# Altium schematic sheet LED_V2.SchDoc
size A
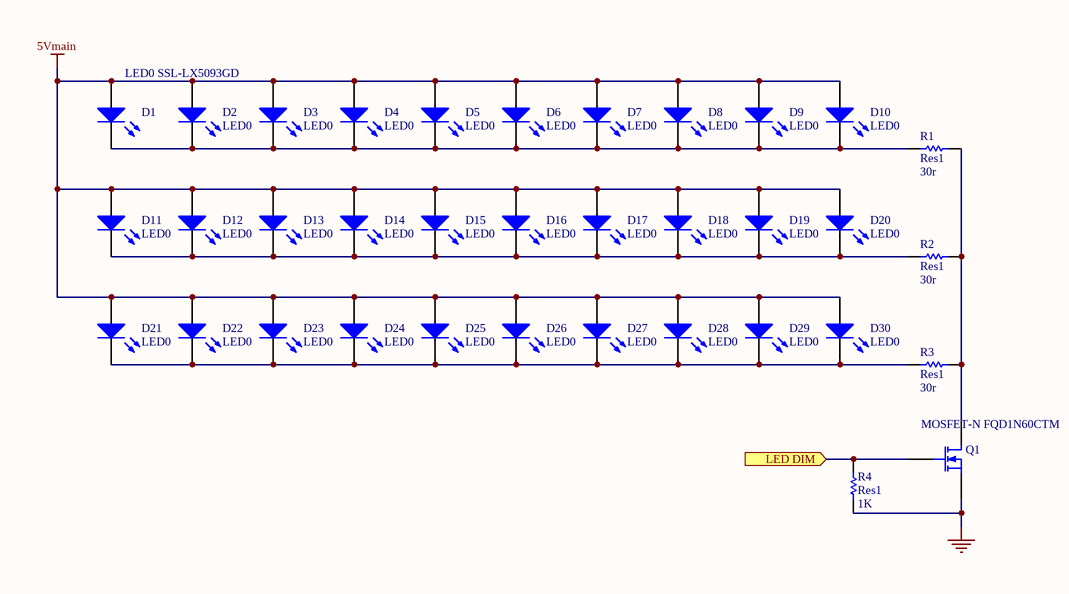
[diagram p0: LED_V2.SchDoc]

## Parts
D1  LED0 SSL-LX5093GD  [LED-0]
D2  LED0  [LED-0]
D3  LED0  [LED-0]
D4  LED0  [LED-0]
D5  LED0  [LED-0]
D6  LED0  [LED-0]
D7  LED0  [LED-0]
D8  LED0  [LED-0]
D9  LED0  [LED-0]
D10  LED0  [LED-0]
D11  LED0  [LED-0]
D12  LED0  [LED-0]
D13  LED0  [LED-0]
D14  LED0  [LED-0]
D15  LED0  [LED-0]
D16  LED0  [LED-0]
D17  LED0  [LED-0]
D18  LED0  [LED-0]
D19  LED0  [LED-0]
D20  LED0  [LED-0]
D21  LED0  [LED-0]
D22  LED0  [LED-0]
D23  LED0  [LED-0]
D24  LED0  [LED-0]
D25  LED0  [LED-0]
D26  LED0  [LED-0]
D27  LED0  [LED-0]
D28  LED0  [LED-0]
D29  LED0  [LED-0]
D30  LED0  [LED-0]
Q1  MOSFET-N FQD1N60CTM  [TO252]
R1  Res1  value 30r  [AXIAL-0.3]
R2  Res1  value 30r  [AXIAL-0.3]
R3  Res1  value 30r  [AXIAL-0.3]
R4  Res1  value 1K  [AXIAL-0.3]

## Ports
LED DIM (in)

## Nets
5Vmain: D1.1(A) D2.1(A) D3.1(A) D4.1(A) D5.1(A) D6.1(A) D7.1(A) D8.1(A) D9.1(A) D10.1(A) D11.1(A) D12.1(A) D13.1(A) D14.1(A) D15.1(A) D16.1(A) D17.1(A) D18.1(A) D19.1(A) D20.1(A) D21.1(A) D22.1(A) D23.1(A) D24.1(A) D25.1(A) D26.1(A) D27.1(A) D28.1(A) D29.1(A) D30.1(A)
GND: Q1.3(S) R4.1
LED DIM: Q1.1(G) R4.2 ; port LED DIM
NetD1_2: D1.2(K) D2.2(K) D3.2(K) D4.2(K) D5.2(K) D6.2(K) D7.2(K) D8.2(K) D9.2(K) D10.2(K) R1.1
NetD11_2: D11.2(K) D12.2(K) D13.2(K) D14.2(K) D15.2(K) D16.2(K) D17.2(K) D18.2(K) D19.2(K) D20.2(K) R2.1
NetD21_2: D21.2(K) D22.2(K) D23.2(K) D24.2(K) D25.2(K) D26.2(K) D27.2(K) D28.2(K) D29.2(K) D30.2(K) R3.1
NetQ1_2: Q1.2(D) R1.2 R2.2 R3.2

## Library data of the parts
D1-D30 = LED0: Typical INFRARED GaAs LED; Published: 8-Jun-2000; LatestRevisionDate: 08-Jul-2005; LatestRevisionNote: Mech Layer 1 removed.; PackageReference: LED-0; Publisher: Altium Limited; PackageDescription: LED; 2 Leads
Q1 = MOSFET-N: N-Channel MOSFET; fabricant: FAIRCHILD SEMICONDUCTOR; fournisseur: FARNELL; reffournisseur: 2322627; Published: 8-Jun-2000; LatestRevisionDate: 17-Jul-2002; LatestRevisionNote: Re-released for DXP Platform.; PackageVersion: 1995/1996; PackageReference: E3; Publisher: Altium Limited; PackageDescription: TO, Flat Index; 3 In-Line, Axial Leads; Body Dia. 4.6mm; Lead Dia. 0.5 mm (max); reffabricant: FQD1N60CTM
R1-R4 = Res1: Resistor; Published: 8-Jun-2000; LatestRevisionDate: 17-Jul-2002; LatestRevisionNote: Re-released for DXP Platform.; PackageReference: AXIAL-0.3; Publisher: Altium Limited; PackageDescription: Axial Device, Thru-Hole; 2 Leads; 0.3 in Pin Spacing